# Altium schematic sheet Power supply.SchDoc
size A4; Author: Esteban Durán Madrid; CompanyName: Universidad de Santiago de Chile; Address1: Avenida Ecuador Nº 3519; Address2: Estación Central, Santiago; Address3: Chile; DocumentNumber: 1; SheetNumber: 1; SheetTotal: 1
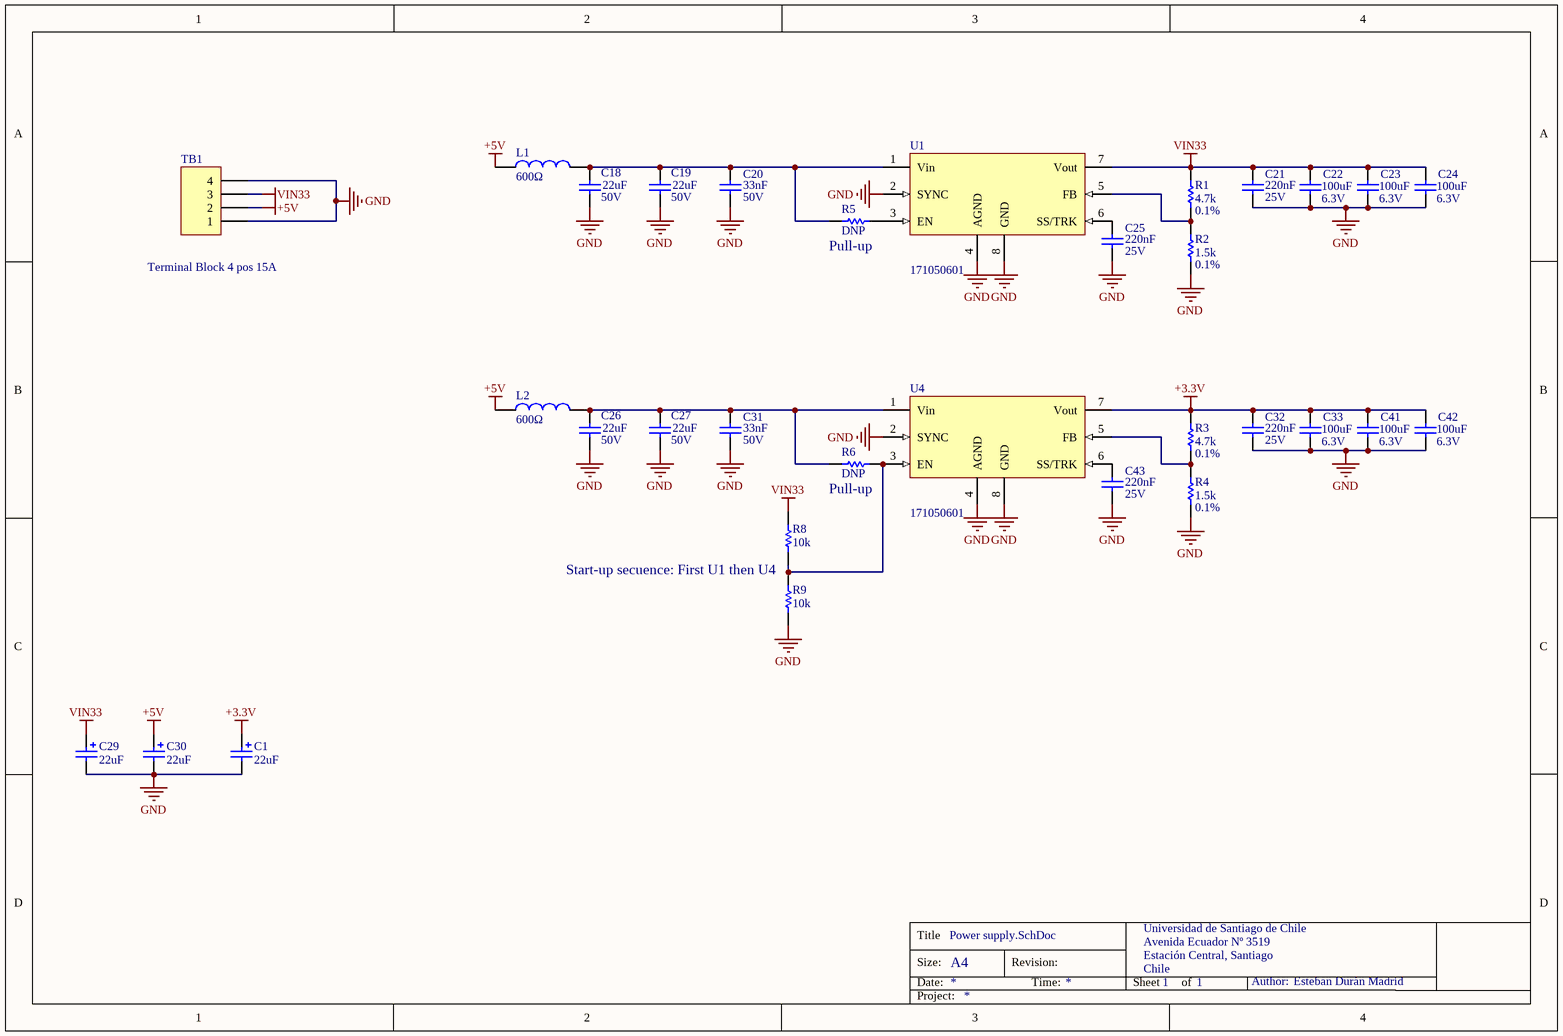
[diagram p0: Power supply.SchDoc]

## Parts
C1  22uF  [CAP Electrolítico Radial SMD2]
C18  22uF  Voltage: 50V  [RES_1206]
C19  22uF  Voltage: 50V  [RES_1206]
C20  33nF  Voltage: 50V  [CAP_0603]
C21  220nF  Voltage: 25V  [CAP_0603]
C22  100uF  Voltage: 6.3V  [Cap_1210]
C23  100uF  Voltage: 6.3V  [Cap_1210]
C24  100uF  Voltage: 6.3V  [Cap_1210]
C25  220nF  Voltage: 25V  [CAP_0603]
C26  22uF  Voltage: 50V  [RES_1206]
C27  22uF  Voltage: 50V  [RES_1206]
C29  22uF  [CAP Electrolítico Radial SMD2]
C30  22uF  [CAP Electrolítico Radial SMD2]
C31  33nF  Voltage: 50V  [CAP_0603]
C32  220nF  Voltage: 25V  [CAP_0603]
C33  100uF  Voltage: 6.3V  [Cap_1210]
C41  100uF  Voltage: 6.3V  [Cap_1210]
C42  100uF  Voltage: 6.3V  [Cap_1210]
C43  220nF  Voltage: 25V  [CAP_0603]
L1  600Ω  [WE-CBF_0805_High Current]
L2  600Ω  [WE-CBF_0805_High Current]
R1  4.7k  Tolerance: 0.1%  [RES_0603]
R2  1.5k  Tolerance: 0.1%  [RES_0603]
R3  4.7k  Tolerance: 0.1%  [RES_0603]
R4  1.5k  Tolerance: 0.1%  [RES_0603]
R5  DNP  [RES_0603]
R6  DNP  [RES_0603]
R8  10k  [RES_0603]
R9  10k  [RES_0603]
TB1  Terminal Block 4 pos 15A  [Terminal Block 4 pos 15A]
U1  171050601  [7TO-PMOD]
U4  171050601  [7TO-PMOD]

## Nets
+3.3V: C1.1 C32.1 C33.1 C41.1 C42.1 R3.2 U4.7(Vout)
+5V: C30.1 L1.1 L2.1 TB1.2
GND: C1.2 C18.2 C19.2 C20.2 C21.2 C22.2 C23.2 C24.2 C25.2 C26.2 C27.2 C29.2 C30.2 C31.2 C32.2 C33.2 C41.2 C42.2 C43.2 R2.1 R4.1 R9.1 TB1.1 TB1.4 U1.2(SYNC) U1.4(AGND) U1.8(GND) U4.2(SYNC) U4.4(AGND) U4.8(GND)
VIN33: C21.1 C22.1 C23.1 C24.1 C29.1 R1.2 R8.1 TB1.3 U1.7(Vout)
NetC18_1: C18.1 C19.1 C20.1 L1.2 R5.2 U1.1(Vin)
NetC25_1: C25.1 U1.6(SS/TRK)
NetC26_1: C26.1 C27.1 C31.1 L2.2 R6.2 U4.1(Vin)
NetC43_1: C43.1 U4.6(SS/TRK)
NetR1_1: R1.1 R2.2 U1.5(FB)
NetR3_1: R3.1 R4.2 U4.5(FB)
NetR5_1: R5.1 U1.3(EN)
NetR6_1: R6.1 R8.2 R9.2 U4.3(EN)

## Notes on the sheet
- Pull-up
- Start-up secuence: First U1 then U4
- Title
- Size:
- Date:
- A4
- Revision:
- Time:
- Sheet
- of
- Author:
- Project:

## Library data of the parts
C1 C29 C30 = Cap Pol: Polarized Capacitor (Radial); Manufacturer Part-Number: EEE-FK1C220R; Published: 8-Jun-2000; LatestRevisionDate: 17-Jul-2002; LatestRevisionNote: Re-released for DXP Platform.; PackageReference: RB7.6-15; Publisher: Altium Limited; PackageDescription: Polarized Capacitor (Radial); 2 Leads; Value: 22uF; Digikey Part-Number: PCE3785CT-ND
C18 C19 C26 C27 = Cap_1206: Capacitor; Manufacturer Part-Number: C2220C226M5R2CAUTO; Published: 8-Jun-2000; LatestRevisionDate: 17-Jul-2002; LatestRevisionNote: Re-released for DXP Platform.; PackageReference: RAD-0.3; Publisher: Altium Limited; Digikey Part-Number: 399-5797-1-ND; Value: 22uF
C20 C31 = Cap_0603: Capacitor; Manufacturer Part-Number: GCM188R71H332KA37D; Rule: PcbType=ProtelPcb; Published: 8-Jun-2000; LatestRevisionDate: 17-Jul-2002; LatestRevisionNote: Re-released for DXP Platform.; PackageReference: RAD-0.3; Publisher: Altium Limited; Value: 33nF; Digikey Part-Number: 490-8023-1-ND
C21 C25 C32 C43 = Cap_0603: Capacitor; Manufacturer Part-Number: GCM188R71E224KA55D; Rule: PcbType=ProtelPcb; Published: 8-Jun-2000; LatestRevisionDate: 17-Jul-2002; LatestRevisionNote: Re-released for DXP Platform.; PackageReference: RAD-0.3; Publisher: Altium Limited; Value: 220nF; Digikey Part-Number: 490-4935-1-ND
C22-C24 C33 C41 C42 = Cap_1210: Capacitor; Manufacturer Part-Number: GRM31CR60J107ME39L; Published: 8-Jun-2000; LatestRevisionDate: 17-Jul-2002; LatestRevisionNote: Re-released for DXP Platform.; PackageReference: RAD-0.3; Publisher: Altium Limited; Digikey Part-Number: 490-4539-1-ND; Value: 100uF
L1 L2 = WE-CBF, 742792040: WE-CBF SMD EMI Suppression Ferrite Bead, 0805, 600Ω; Type: High Current; PublishedDate: Aug 2016; Publisher: Wurth Elektronik; ComponentLink1Description: Manufacturer; ComponentLink1URL: http://www.we-online.de; ComponentLink2Description: Datasheet; ComponentLink2URL: http://katalog.we-online.de/pbs/datasheet/742792040.pdf; PartNumber: 742792040; Value: 600Ω; Size: 0805; Created: 2018_09_11_AGeiger; Digikey Part-Number: 732-1620-1-ND; Manufacturer Part-Number: 742792040
R1 R3 = Res0603: Manufacturer Part-Number: TNPW06034K70BEEA; Published: 8-Jun-2000; LatestRevisionDate: 17-Jul-2002; LatestRevisionNote: Re-released for DXP Platform.; PackageReference: AXIAL-0.3; Publisher: Altium Limited; PackageDescription: Axial Device, Thru-Hole; 2 Leads; 0.3 in Pin Spacing; Digikey Part-Number: TNP4.70KAACT-ND; Value: 4.7k
R2 R4 = Res0603: Manufacturer Part-Number: ERA-3AEB152V; Published: 8-Jun-2000; LatestRevisionDate: 17-Jul-2002; LatestRevisionNote: Re-released for DXP Platform.; PackageReference: AXIAL-0.3; Publisher: Altium Limited; PackageDescription: Axial Device, Thru-Hole; 2 Leads; 0.3 in Pin Spacing; Digikey Part-Number: P1.5KDBCT-ND; Value: 1.5k
R5 R6 = Res0603: Manufacturer Part-Number: RT0603DRD0710KL; Value: 10k; Published: 8-Jun-2000; LatestRevisionDate: 17-Jul-2002; LatestRevisionNote: Re-released for DXP Platform.; PackageReference: AXIAL-0.3; Publisher: Altium Limited; PackageDescription: Axial Device, Thru-Hole; 2 Leads; 0.3 in Pin Spacing; Digikey Part-Number: 311-10KDCT-ND
R8 R9 = Res0603: Manufacturer Part-Number: RT0603DRD0710KL; Published: 8-Jun-2000; LatestRevisionDate: 17-Jul-2002; LatestRevisionNote: Re-released for DXP Platform.; PackageReference: AXIAL-0.3; Publisher: Altium Limited; PackageDescription: Axial Device, Thru-Hole; 2 Leads; 0.3 in Pin Spacing; Value: 10k; Digikey Part-Number: 311-10KDCT-ND
TB1 = Terminal Block 4 pos 15A: Molex Through Hole; Manufacturer Part-Number: 0387206304; LatestRevisionDate: 17-Jul-2002; LatestRevisionNote: Re-released for DXP Platform.; Publisher: Altium Limited; Digikey Part-Number: WM5742-ND
U1 U4 = WE-DCDC-171050601: DC/DC VIN = 6V-36V, 5A, VOUT = 0.8V-6V; Manufacturer: Wuerth Elektronik; AN: 26051; Mixed: SMT; Case: TO263-7EP; HelpURL: B:\AD\adlib\datasheet\171050601; Value: 171050601; Created: 2018_09_06_AGeiger; Supplier Part Number 1: 710-171050601; Supplier 1: Mouser; ComponentLink1URL: https://www.mouser.de/datasheet/2/445/171050601-336102.pdf; ComponentLink1Description: Datasheet; Digikey Part-Number: 732-6216-1-ND; Manufacturer Part-Number: 171050601